# EAGLE schematic Arduino_fuer_LEDs_DCC_Old_1.7 (EAGLE 9.5.2)

## Sheet 1 of 2
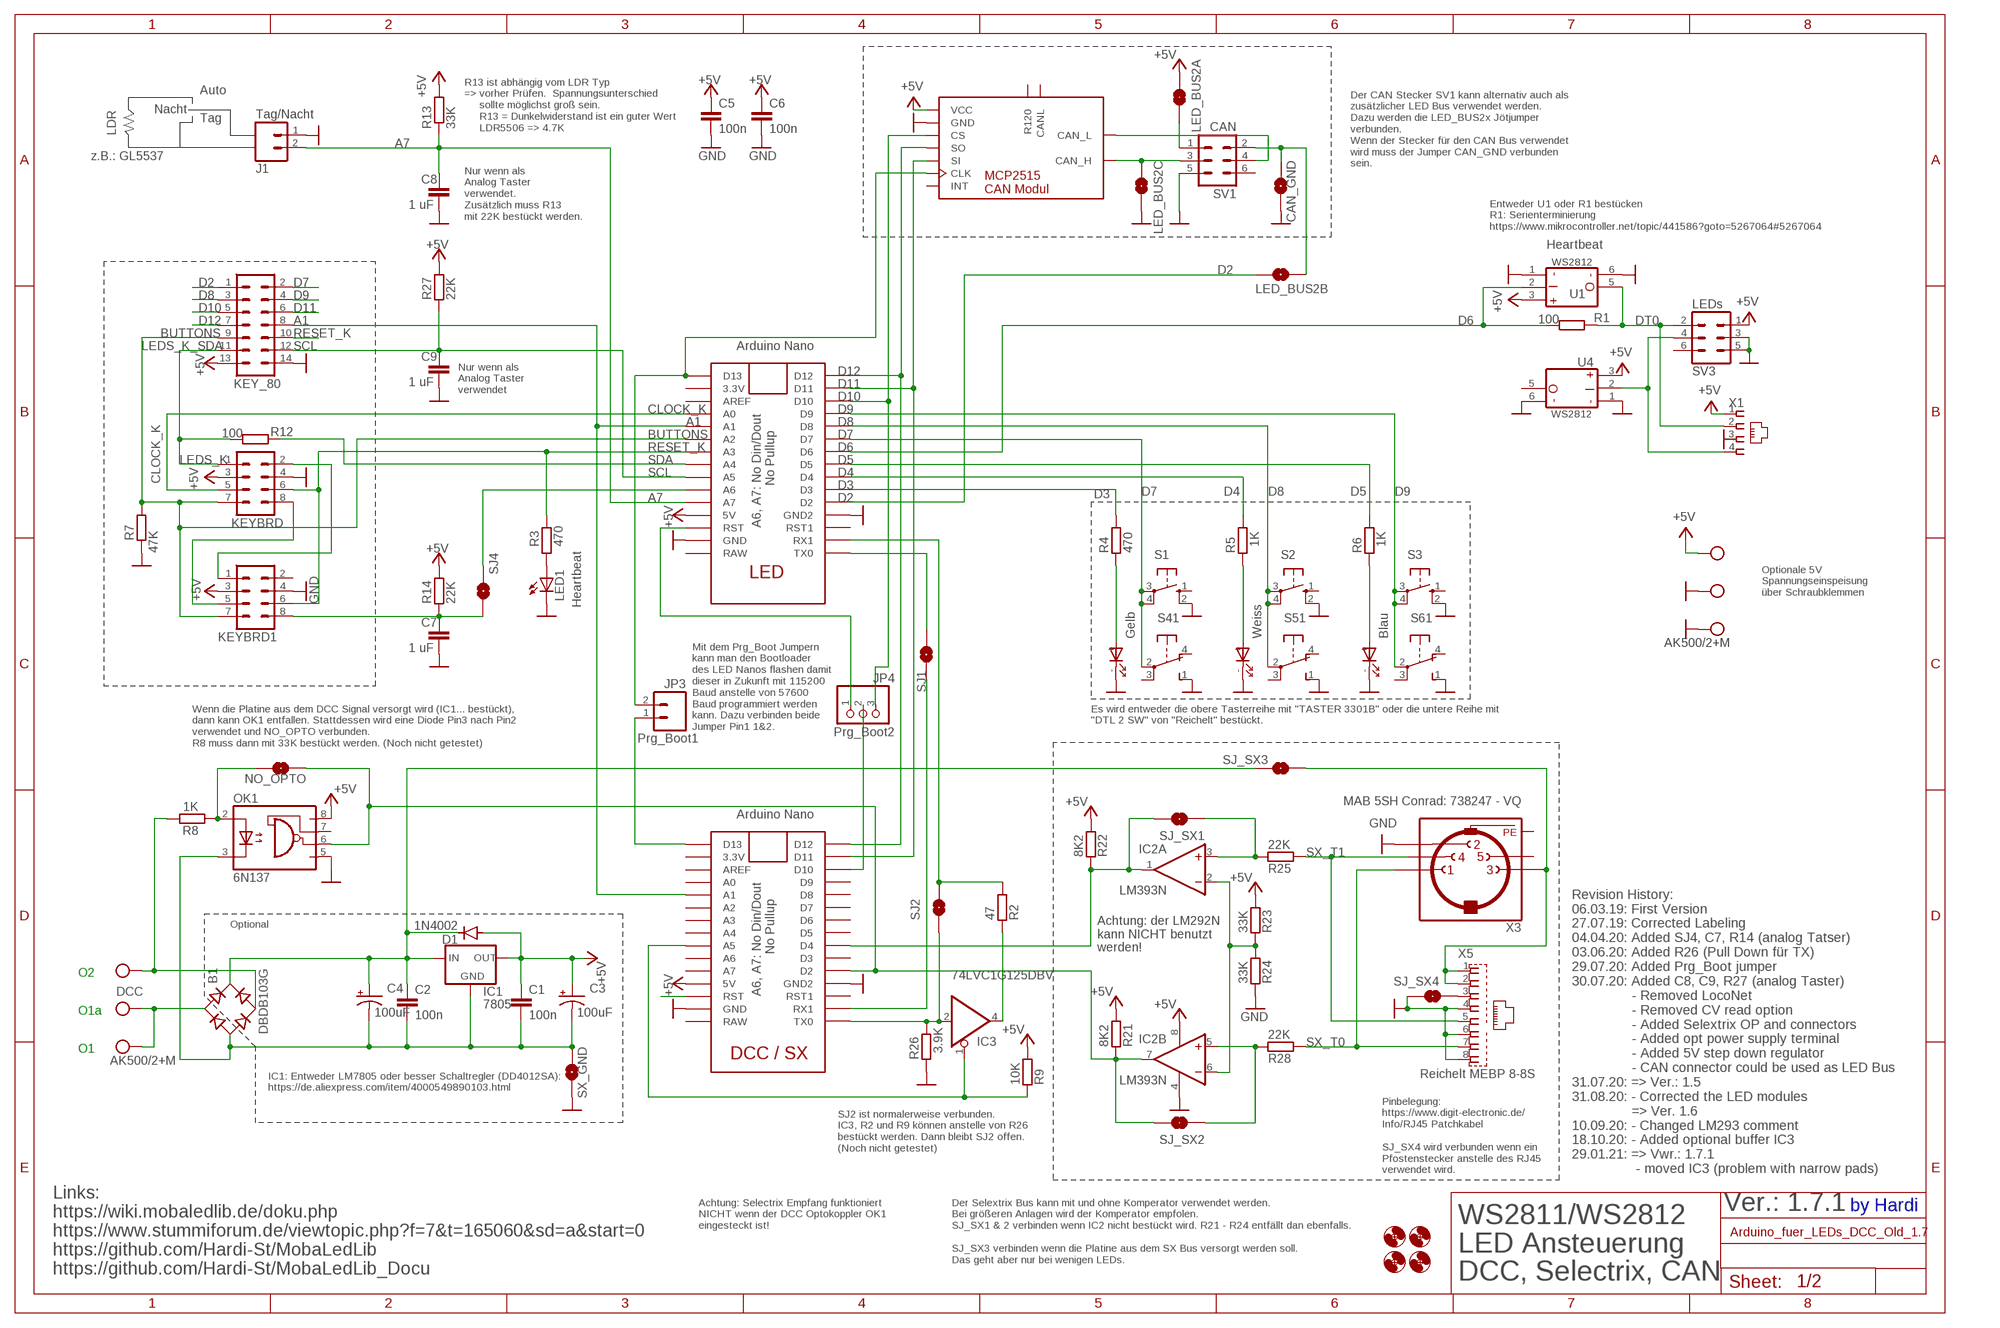
[diagram p0: schematic, sheet 1]

### Parts
B1  DBDB103G  DBDB10G  [DB]
C1  100n  C-EU025-025X050  [C025-025X050]
C2  100n  C-EU025-025X050  [C025-025X050]
C3  100uF  SPARKFUN-CAPACITORS_100UF-25V-20%(PTH)  [SPARKFUN-CAPACITORS_CPOL-RADIAL-100UF-25V]
C4  100uF  SPARKFUN-CAPACITORS_100UF-25V-20%(PTH)  [SPARKFUN-CAPACITORS_CPOL-RADIAL-100UF-25V]
C5  100n  C-EU025-025X050  [C025-025X050]
C6  100n  C-EU025-025X050  [C025-025X050]
C7  1 uF  C-EU025-025X050  [C025-025X050]
C8  1 uF  C-EU025-025X050  [C025-025X050]
C9  1 uF  C-EU025-025X050  [C025-025X050]
CAN2  MCP2515_CAN_MODUL  [MCP2515_CAN_MODUL]
CAN_GND  SOLDERJUMPERNO  [SJ_2S-NO]
D1  1N4002  1N4004  [DO41-10]
H1  MOUNT-HOLE3.0  [3,0]
H2  MOUNT-HOLE3.0  [3,0]
H3  MOUNT-HOLE3.0  [3,0]
H4  MOUNT-HOLE3.0  [3,0]
IC1  7805  78XXS  [78XXS]
IC2  LM393N  [DIL08]
IC3  74LVC1G125DBV  [SOT23-5]
J1  Tag/Nacht  M02PTH  [1X02]
JP3  Prg_Boot1  M02PTH  [1X02]
JP4  Prg_Boot2  PINHD-1X3CB  [1X03-CLEANBIG]
KEY_80  ML14  [ML14]
KEYBRD  CON-HARTING-ML_ML08  [CON-HARTING-ML_ML08]
KEYBRD1  CON-HARTING-ML_ML08  [CON-HARTING-ML_ML08]
LED1  Heartbeat  LED3MM  [LED3MM]
LED_BUS2A  SOLDERJUMPERNO  [SJ_2S-NO]
LED_BUS2B  SOLDERJUMPERNO  [SJ_2S-NO]
LED_BUS2C  SOLDERJUMPERNO  [SJ_2S-NO]
NO_OPTO  SOLDERJUMPERNO  [SJ_2S-NO]
OK1  6N137  [DIL08]
R1  100  R0204/7  [0204/7]
R2  47  R-EU_0204/7  [0204/7]
R3  470  R0204/7  [0204/7]
R4  470  R0204/7  [0204/7]
R5  1K  R0204/7  [0204/7]
R6  1K  R0204/7  [0204/7]
R7  47K  R0204/7  [0204/7]
R8  1K  R0204/7  [0204/7]
R9  10K  R-EU_0204/5  [0204/5]
R12  100  R0204/7  [0204/7]
R13  33K  R0204/7  [0204/7]
R14  22K  R0204/7  [0204/7]
R21  8K2  R-EU_0207/2V  [0207/2V]
R22  8K2  R-EU_0207/2V  [0207/2V]
R23  33K  R-EU_0207/2V  [0207/2V]
R24  33K  R-EU_0207/2V  [0207/2V]
R25  22K  R-EU_0207/2V  [0207/2V]
R26  3.9K  R0204/7  [0204/7]
R27  22K  R0204/7  [0204/7]
R28  22K  R-EU_0207/2V  [0207/2V]
S1  10-XX  [B3F-10XX]
S2  10-XX  [B3F-10XX]
S3  10-XX  [B3F-10XX]
S4  Gelb  SRKL  [SRKL]
S5  Weiss  SRKL  [SRKL]
S6  Blau  SRKL  [SRKL]
SJ1  SOLDERJUMPERNO  [SJ_2S-NO]
SJ2  SOLDERJUMPERNO  [SJ_2S-NO]
SJ4  SOLDERJUMPERNO  [SJ_2S-NO]
SJ_SX1  SOLDERJUMPERNO  [SJ_2S-NO]
SJ_SX2  SOLDERJUMPERNO  [SJ_2S-NO]
SJ_SX3  SOLDERJUMPERNO  [SJ_2S-NO]
SJ_SX4  SOLDERJUMPERNO  [SJ_2S-NO]
SV1  CAN  ML6  [ML6]
SV3  LEDs  ML6  [ML6]
SX_GND  SOLDERJUMPERNO  [SJ_2S-NO]
U1  WS2812_MODUL  [WS2812_LED_MODUL]
U2  LED NANO  NANO  [NANO]
U3  DCC NANO  NANO  [NANO]
U4  WS2812_MODUL  [WS2812_LED_MODUL]
X1  RJ10  [RJ10]
X2  AK500/2+M  [AK500/2+M]
X3  MAB 5SH Conrad: 738247 - VQ  MAB5SH  [MAB5SH]
X4  AK500/2+M  [AK500/2+M]
X5  Reichelt MEBP 8-8S  RJ45_MEBP8-8S  [RJ45_MEBP8-8S]

### Nets
+5V: C1.1 C3.1(+) C5.1 C6.1 CAN2.1(VCC) D1.A IC1.OUT IC2.8(P:V+) KEY_80.13 KEYBRD1.3 KEYBRD.3 LED_BUS2A.1 OK1.8(VCC) R9.2 R13.2 R14.2 R21.2 R22.2 R23.2 R27.2 SV3.1 U1.3(VDD) U2.5V U3.5V U4.3(VDD) X1.1 X4.2 ; also sheet 2
A1: KEY_80.8 U2.A1 U3.A1
A7: C8.1 J1.2 R13.1 U2.A7
BUTTONS: KEY_80.9 KEYBRD1.7 KEYBRD.7 R7.2 U2.A2
CAN_H: CAN2.9(CAN_H) LED_BUS2C.1 SV1.3
CAN_L: CAN2.8(CAN_L) SV1.4
CLOCK_K: KEYBRD.5 U2.A0
D2: KEY_80.1 LED_BUS2B.1 U2.D2
D3: R4.2 U2.D3
D4: R5.2 U2.D4
D5: R6.2 U2.D5
D6: R1.2 U1.2(DIN) U2.D6
D7: KEY_80.2 S1.3(P) S1.4(P1) S4.2(1:P) U2.D7
D8: KEY_80.3 S2.3(P) S2.4(P1) S5.2(1:P) U2.D8
D9: KEY_80.4 S3.3(P) S3.4(P1) S6.2(1:P) U2.D9
D10: CAN2.3(CS) JP4.3 KEY_80.5 U2.D10
D11: CAN2.5(SI) KEY_80.6 U2.D11 U3.D11
D12: CAN2.4(SO) KEY_80.7 U2.D12 U3.D12
DT0: R1.1 SV3.2 U1.5(DO) X1.2 ; also sheet 2
GND: C5.2 C6.2 C7.2 C8.2 C9.2 CAN2.2(GND) CAN_GND.2 IC2.4(P:V-) J1.1 KEY_80.14 KEYBRD1.4 KEYBRD.4 LED1.K(C) LED_BUS2C.2 OK1.5(GND) R7.1 R24.1 R26.1 S1.2(S1) S2.2(S1) S3.2(S1) S4.1(1:S) S4.-(D1:C) S5.1(1:S) S5.-(D1:C) S6.1(1:S) S6.-(D1:C) SJ_SX4.2 SV1.5 SV3.3 SV3.5 SX_GND.2 U1.1(GND) U1.6(GND1) U2.GND U2.GND1(GND2) U3.GND U3.GND1(GND2) U4.1(GND) U4.6(GND1) X1.3 X3.2 X4.1 X4.M X5.4 X5.6 X5.8 ; also sheet 2
LEDS_K_SDA: KEY_80.11 KEYBRD.1 R12.2
N$1: SJ1.2 U2.TX0
N$2: SJ_SX4.1 X5.3
N$3: IC3.1(OE) R9.1 U3.A5
N$4: R4.1 S4.+(D1:A)
N$5: CAN2.6(CLK) JP3.2 U2.D13
N$6: R5.1 S5.+(D1:A)
N$7: R6.1 S6.+(D1:A)
N$8: IC2.7(B:OUT) NO_OPTO.1 OK1.6(VO) R21.1 SJ_SX2.2 U3.D2
N$9: U3.RST
N$10: LED_BUS2A.2 SV1.1
N$11: SV3.4 U4.2(DIN) X1.4
N$12: B1.AC2 R8.2 X2.2
N$13: B1.AC1 X2.1 X2.M
N$14: B1.+ C2.1 C4.1(+) D1.C IC1.IN SJ_SX3.2
N$15: JP4.1 U2.RST
N$16: IC2.1(A:OUT) R22.1 SJ_SX1.2 U3.D4
N$17: B1.- C1.2 C2.2 C3.2(-) C4.2(-) IC1.GND OK1.3(C) SX_GND.1
N$18: SJ1.1 U3.RX1
N$19: LED1.A R3.1
N$20: JP3.1 U3.D13
N$21: NO_OPTO.2 OK1.2(A) R8.1
N$23: C7.1 KEYBRD1.8 R14.1 SJ4.2
N$24: KEYBRD1.1 KEYBRD.2
N$25: KEYBRD1.5 KEYBRD.8
N$26: SJ_SX3.1 X3.3 X5.1 X5.2
N$27: SJ4.1 U2.A6
N$28: JP4.2 U3.D10
N$29: CAN_GND.1 LED_BUS2B.2 SV1.2
N$31: IC3.2(I) R26.2 SJ2.1 U3.TX0
N$33: IC3.4(O) R2.1
N$34: R2.2 SJ2.2 U2.RX1
N$38: IC2.2(A:-IN) IC2.6(B:-IN) R23.1 R24.2
N$39: IC2.3(A:+IN) R25.1 SJ_SX1.1
N$42: IC2.5(B:+IN) R28.1 SJ_SX2.1
RESET_K: KEY_80.10 KEYBRD1.6 KEYBRD.6 R3.2 U2.A3
SCL: C9.1 KEY_80.12 R27.1 U2.A5
SDA: R12.1 U2.A4
SX_T0: R28.2 X3.1 X5.7
SX_T1: R25.2 X3.4 X5.5
Unconnected: CAN2.7(INT) CAN2.10(R120) CAN2.11(CANL) KEYBRD1.2 OK1.7(VE) S1.1(S) S2.1(S) S3.1(S) S4.3(1:P) S4.4(1:O) S5.3(1:P) S5.4(1:O) S6.3(1:P) S6.4(1:O) SV1.6 SV3.6 U2.3.3V U2.AREF U2.RAW U2.RST1 U3.3.3V U3.A0 U3.A2 U3.A3 U3.A4 U3.A6 U3.A7 U3.AREF U3.D3 U3.D5 U3.D6 U3.D7 U3.D8 U3.D9 U3.RAW U3.RST1 U4.5(DO) X3.5

### Notes on the sheet
- R13 ist abhängig vom LDR Typ
  => vorher Prüfen.  Spannungsunterschied
       sollte möglichst groß sein.
       R13 = Dunkelwiderstand ist ein guter Wert
       LDR5506 => 4.7K
- Der CAN Stecker SV1 kann alternativ auch als
  zusätzlicher LED Bus verwendet werden.
  Dazu werden die LED_BUS2x Jötjumper
  verbunden.
  Wenn der Stecker für den CAN Bus verwendet
  wird muss der Jumper CAN_GND verbunden
  sein.
- Auto
- Nacht
- Tag
- LDR
- z.B.: GL5537
- Nur wenn als
  Analog Taster
  verwendet.
  Zusätzlich muss R13 
  mit 22K bestückt werden.
- Entweder U1 oder R1 bestücken 
  R1: Serienterminierung
  https://www.mikrocontroller.net/topic/441586?goto=5267064#5267064
- Heartbeat
- Nur wenn als
  Analog Taster
  verwendet
- LEDS_K
- A6, A7: No Din/Dout 
              No Pullup
- LED
- Optionale 5V
  Spannungseinspeisung
  über Schraubklemmen
- Wenn die Platine aus dem DCC Signal versorgt wird (IC1... bestückt), 
  dann kann OK1 entfallen. Stattdessen wird eine Diode Pin3 nach Pin2
  verwendet und NO_OPTO verbunden.
  R8 muss dann mit 33K bestückt werden. (Noch nicht getestet)
- Es wird entweder die obere Tasterreihe mit "TASTER 3301B" oder die untere Reihe mit 
  "DTL 2 SW" von "Reichelt" bestückt.
- Mit dem Prg_Boot Jumpern
  kann man den Bootloader
  des LED Nanos flashen damit
  dieser in Zukunft mit 115200
  Baud anstelle von 57600
  Baud programmiert werden 
  kann. Dazu verbinden beide
  Jumper Pin1 1&2.
- Optional
- Achtung: der LM292N
  kann NICHT benutzt
  werden!
- O2
- DCC
- A6, A7: No Din/Dout 
              No Pullup
- O1a
- DCC / SX
- O1
- IC1: Entweder LM7805 oder besser Schaltregler (DD4012SA):
  https://de.aliexpress.com/item/4000549890103.html
- Pinbelegung:
  https://www.digit-electronic.de/
  Info/RJ45 Patchkabel
  
  SJ_SX4 wird verbunden wenn ein 
  Pfostenstecker anstelle des RJ45 
  verwendet wird.
- SJ2 ist normalerweise verbunden.
  IC3, R2 und R9 können anstelle von R26
  bestückt werden. Dann bleibt SJ2 offen.
  (Noch nicht getestet)
- Revision History:
  06.03.19: First Version
  27.07.19: Corrected Labeling
  04.04.20: Added SJ4, C7, R14 (analog Tatser)
  03.06.20: Added R26 (Pull Down für TX)
  29.07.20: Added Prg_Boot jumper
  30.07.20: Added C8, C9, R27 (analog Taster)
                 - Removed LocoNet
                 - Removed CV read option
                 - Added Selextrix OP and connectors
                 - Added opt power supply terminal 
                 - Added 5V step down regulator
                 - CAN connector could be used as LED Bus
  31.07.20: => Ver.: 1.5
  31.08.20: - Corrected the LED modules
                 => Ver. 1.6
  10.09.20: - Changed LM293 comment
  18.10.20: - Added optional buffer IC3
  29.01.21: => Vwr.: 1.7.1
                  - moved IC3 (problem with narrow pads)
- Achtung: Selectrix Empfang funktioniert
  NICHT wenn der DCC Optokoppler OK1
  eingesteckt ist!
- Der Selextrix Bus kann mit und ohne Komperator verwendet werden.
  Bei größeren Anlagen wird der Komperator empfolen. 
  SJ_SX1 & 2 verbinden wenn IC2 nicht bestückt wird. R21 - R24 entfällt dan ebenfalls.
  
  SJ_SX3 verbinden wenn die Platine aus dem SX Bus versorgt werden soll.
  Das geht aber nur bei wenigen LEDs.
- Ver.: 1.7.1 | by Hardi
- Links:
  https://wiki.mobaledlib.de/doku.php
  https://www.stummiforum.de/viewtopic.php?f=7&t=165060&sd=a&start=0
  https://github.com/Hardi-St/MobaLedLib
  https://github.com/Hardi-St/MobaLedLib_Docu
- WS2811/WS2812
  LED Ansteuerung
  DCC, Selectrix, CAN

## Sheet 2 of 2
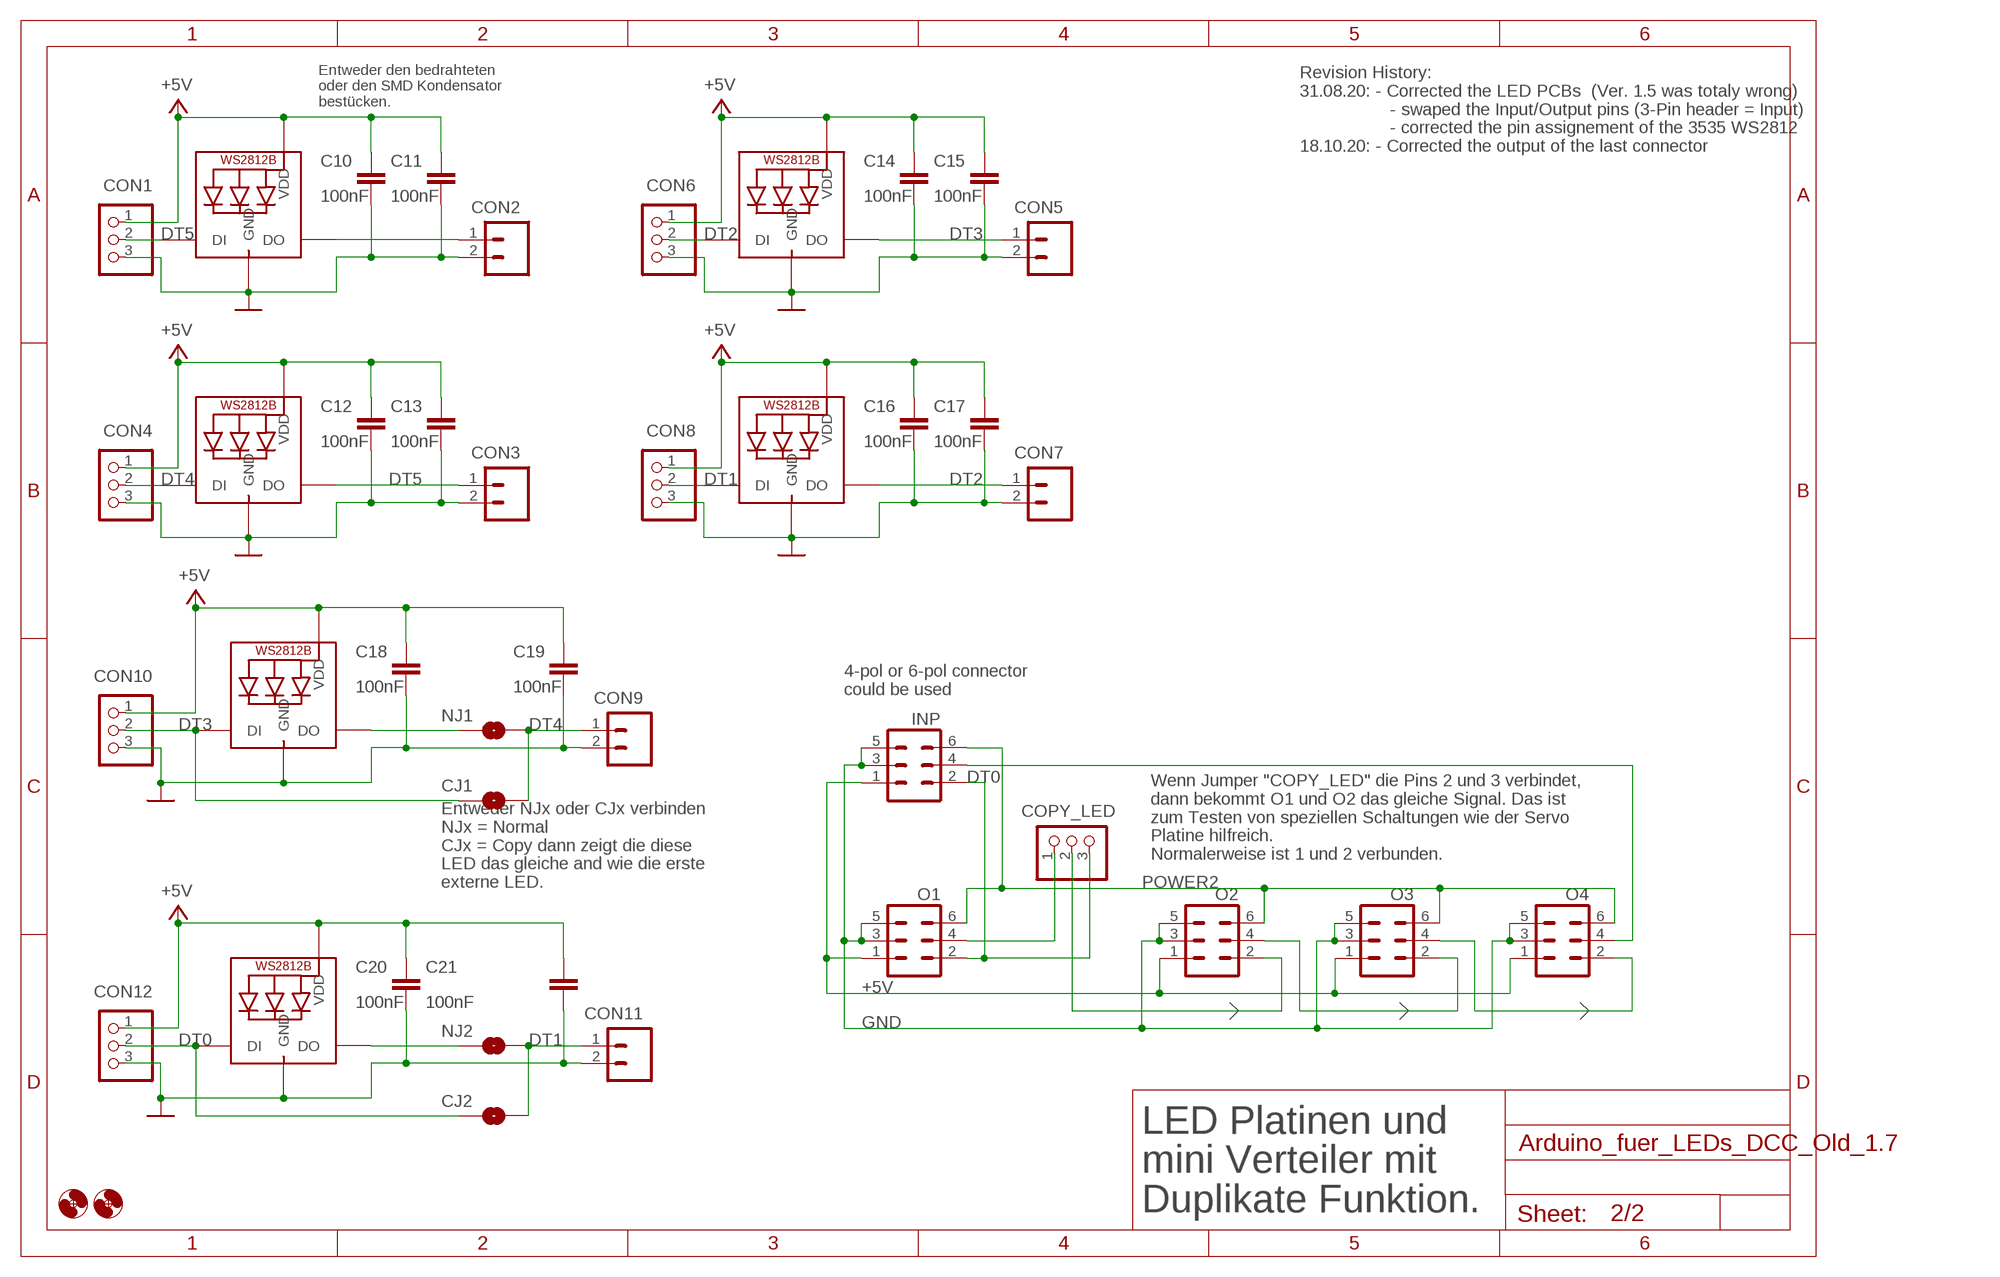
[diagram p1: schematic, sheet 2]

### Parts
C10  100nF  C-EU025-025X050  [C025-025X050]
C11  100nF  C-EUC1206  [C1206]
C12  100nF  C-EU025-025X050  [C025-025X050]
C13  100nF  C-EUC1206  [C1206]
C14  100nF  C-EU025-025X050  [C025-025X050]
C15  100nF  C-EUC1206  [C1206]
C16  100nF  C-EU025-025X050  [C025-025X050]
C17  100nF  C-EUC1206  [C1206]
C18  100nF  C-EU025-025X050  [C025-025X050]
C19  100nF  C-EUC1206  [C1206]
C20  100nF  C-EU025-025X050  [C025-025X050]
C21  100nF  C-EUC1206  [C1206]
CJ1  SOLDERJUMPERNO  [SJ_2S-NO]
CJ2  SOLDERJUMPERNO  [SJ_2S-NO]
CON1  PINHD-1X3CB  [1X03-CLEANBIG]
CON2  M02PTH  [1X02]
CON3  M02PTH  [1X02]
CON4  PINHD-1X3CB  [1X03-CLEANBIG]
CON5  M02PTH  [1X02]
CON6  PINHD-1X3CB  [1X03-CLEANBIG]
CON7  M02PTH  [1X02]
CON8  PINHD-1X3CB  [1X03-CLEANBIG]
CON9  M02PTH  [1X02]
CON10  PINHD-1X3CB  [1X03-CLEANBIG]
CON11  M02PTH  [1X02]
CON12  PINHD-1X3CB  [1X03-CLEANBIG]
COPY_LED  PINHD-1X3CB  [1X03-CLEANBIG]
H5  MOUNT-HOLE3.0  [3,0]
H6  MOUNT-HOLE3.0  [3,0]
INP  ML6  [ML6]
LED2  WS2812B5050  [WS2812B]
LED3  WS2812B5050  [WS2812B]
LED4  WS2812B3535  [LED3535]
LED5  WS2812B3535  [LED3535]
LED6  WS2812B5050  [WS2812B]
LED7  WS2812B3535  [LED3535]
NJ1  SOLDERJUMPERNO  [SJ_2S-NO]
NJ2  SOLDERJUMPERNO  [SJ_2S-NO]
O1  ML6  [ML6]
O2  ML6  [ML6]
O3  ML6  [ML6]
O4  ML6  [ML6]

### Nets
+5V: C10.1 C11.1 C12.1 C13.1 C14.1 C15.1 C16.1 C17.1 C18.1 C19.1 C20.1 C21.1 CON1.1 CON4.1 CON6.1 CON8.1 CON10.1 CON12.1 INP.1 LED2.1-5V(VDD) LED3.1-5V(VDD) LED4.1_5V(VDD) LED5.1_5V(VDD) LED6.1-5V(VDD) LED7.1_5V(VDD) O1.1 O2.1 O3.1 O4.1 ; also sheet 1
DT0: CJ2.1 CON12.2 COPY_LED.3 INP.2 LED7.4_DIN(DI) O1.2 ; also sheet 1
DT1: CJ2.2 CON8.2 CON11.1 LED5.4_DIN(DI) NJ2.2
DT2: CON6.2 CON7.1 LED4.4_DIN(DI) LED5.2_DOUT(DO)
DT3: CJ1.1 CON5.1 CON10.2 LED4.2_DOUT(DO) LED6.4-DIN(DI)
DT4: CJ1.2 CON4.2 CON9.1 LED3.4-DIN(DI) NJ1.2
DT5: CON1.2 CON3.1 LED2.4-DIN(DI) LED3.2-DOUT(DO)
GND: C10.2 C11.2 C12.2 C13.2 C14.2 C15.2 C16.2 C17.2 C18.2 C19.2 C20.2 C21.2 CON1.3 CON2.2 CON3.2 CON4.3 CON5.2 CON6.3 CON7.2 CON8.3 CON9.2 CON10.3 CON11.2 CON12.3 INP.3 INP.5 LED2.3-GND(GND) LED3.3-GND(GND) LED4.3_GND(GND) LED5.3_GND(GND) LED6.3-GND(GND) LED7.3_GND(GND) O1.3 O1.5 O2.3 O2.5 O3.3 O3.5 O4.3 O4.5 ; also sheet 1
N$22: O3.4 O4.2
N$30: CON2.1 LED2.2-DOUT(DO)
N$49: LED6.2-DOUT(DO) NJ1.1
N$52: INP.4 O4.4
N$55: COPY_LED.2 O2.2
N$56: LED7.2_DOUT(DO) NJ2.1
N$58: O2.4 O3.2
N$60: COPY_LED.1 O1.4
POWER2: INP.6 O1.6 O2.6 O3.6 O4.6

### Notes on the sheet
- Entweder den bedrahteten 
  oder den SMD Kondensator 
  bestücken.
- Revision History:
  31.08.20: - Corrected the LED PCBs  (Ver. 1.5 was totaly wrong)
                    - swaped the Input/Output pins (3-Pin header = Input)
                    - corrected the pin assignement of the 3535 WS2812
  18.10.20: - Corrected the output of the last connector
- 4-pol or 6-pol connector
  could be used
- Wenn Jumper "COPY_LED" die Pins 2 und 3 verbindet,
  dann bekommt O1 und O2 das gleiche Signal. Das ist
  zum Testen von speziellen Schaltungen wie der Servo 
  Platine hilfreich.
  Normalerweise ist 1 und 2 verbunden.
- Entweder NJx oder CJx verbinden
  NJx = Normal
  CJx = Copy dann zeigt die diese
  LED das gleiche and wie die erste
  externe LED.
- LED Platinen und
  mini Verteiler mit 
  Duplikate Funktion.

## Power pins joined to a net without a drawn wire
GND: IC3.3(GND)
PE: X3.PE X3.PE@(PE)
VCC: IC3.5(VCC)

## Library data of the parts
B1 = Arduino_fuer_LEDs_DCC_2:DB?*G: Single Phase 1.0 AMP Glass Passivated Bridge Rectifier Taiwan Semiconductor Co.,Ltd. - TSC Source: http://www.taiwansemi.com/TSCbig5/ezcatfiles/cust/img/img/db101g.pdf http://www.ts.com.tw/db/pictures/modules/PDT/PDT060207001/DBLS201G.pdf
C1 C2 C5-C21 = rcl:C-EU: CAPACITOR, European symbol
C3 C4 = Sound_MP3-TF-16P_and_WS2811:SPARKFUN-CAPACITORS_100UF-25V-20%(PTH): CAP-08439; PROD_ID: CAP-08439
CAN2 = Arduino_fuer_LEDs_DCC_2_All:MCP2515_CAN_MODUL: MCP2515 CAN Modul
CAN_GND CJ1 CJ2 LED_BUS2A LED_BUS2B LED_BUS2C NJ1 NJ2 NO_OPTO SJ1 SJ2 SJ4 SJ_SX1-SJ_SX4 SX_GND = SparkFun-Retired:SOLDERJUMPER: Solder Jumper Standard SMD solder jumper. Used to automate production. Two varients : Normally Open and Normally Closed are the same, but have different paste layers. NC will have a large amount of paste and should jumper during reflow.
CON1 CON4 CON6 CON8 CON10 CON12 COPY_LED JP4 = adafruit:PINHD-1X3: PIN HEADER
CON2 CON3 CON5 CON7 CON9 CON11 J1 JP3 = SparkFun-Connectors:M02: Standard 2-pin 0.1" header. Use with - straight break away headers ( PRT-00116) - right angle break away headers (PRT-00553) - swiss pins (PRT-00743) - machine pins (PRT-00117) - female headers (PRT-00115) Molex polarized connector foot print use with: PRT-08233 with associated crimp pins and housings. 2.54_SCREWTERM for use with PRT-10571. 3.5mm Screw Terminal footprints for PRT-08084 5mm Screw Terminal footprints for use with PRT-08432
D1 = diode:1N4004: DIODE general purpose rectifier, 1 A
H1-H6 = holes:MOUNT-HOLE: MOUNTING HOLE with drill center marker
IC1 = v-reg:78XXS: VOLTAGE REGULATOR
IC2 = linear:LM393: COMPARATOR
IC3 = 74xx-little-de:74*1G125: Single Bus Buffer Gate with 3-State Output
INP O1-O4 = con-harting-ml:ML6: HARTING; OC_FARNELL: unknown; OC_NEWARK: unknown
KEY_80 = Arduino_fuer_LEDs_DCC_2:ML14: HARTING; OC_FARNELL: unknown; OC_NEWARK: unknown
KEYBRD KEYBRD1 = PushButtonAction_4017_2:CON-HARTING-ML_ML08: Modified by Hardi; OC_FARNELL: unknown; OC_NEWARK: unknown
LED1 = Arduino_fuer_LEDs_DCC_2:LED: LED OSRAM: - CHIPLED LG R971, LG N971, LY N971, LG Q971, LY Q971, LO R971, LY R971 LH N974, LH R974 LS Q976, LO Q976, LY Q976 LO Q996 - Hyper CHIPLED LW Q18S LB Q993, LB Q99A, LB R99A - SideLED LS A670, LO A670, LY A670, LG A670, LP A670 LB A673, LV A673, LT A673, LW A673 LH A674 LY A675 LS A676, LA A676, LO A676, LY A676, LW A676 LS A679, LY A679, LG A679 - Hyper Micro SIDELED® LS Y876, LA Y876, LO Y876, LY Y876 LT Y87S - SmartLED LW L88C, LW L88S LB L89C, LB L89S, LG L890 LS L89K, LO L89K, LY L89K LS L896, LA L896, LO L896, LY L896 - TOPLED LS T670, LO T670, LY T670, LG T670, LP T670 LSG T670, LSP T670, LSY T670, LOP T670, LYG T670 LG T671, LOG T671, LSG T671 LB T673, LV T673, LT T673, LW T673 LH T674 LS T676, LA T676, LO T676, LY T676, LB T676, LH T676, LSB T676, LW T676 LB T67C, LV T67C, LT T67C, LS T67K, LO T67K, LY T67K, LW E67C LS E67B, LA E67B, LO E67B, LY E67B, LB E67C, LV E67C, LT E67C LW T67C LS T679, LY T679, LG T679 LS T770, LO T770, LY T770, LG T770, LP T770 LB T773, LV T773, LT T773, LW T773 LH T774 LS E675, LA E675, LY E675, LS T675 LS T776, LA T776, LO T776, LY T776, LB T776 LHGB T686 LT T68C, LB T68C - Hyper Mini TOPLED® LB M676 - Mini TOPLED Santana® LG M470 LS M47K, LO M47K, LY M47K Source: http://www.osram.convergy.de LUXEON: - LUMILED® LXK2-PW12-R00, LXK2-PW12-S00, LXK2-PW14-U00, LXK2-PW14-V00 LXK2-PM12-R00, LXK2-PM12-S00, LXK2-PM14-U00 LXK2-PE12-Q00, LXK2-PE12-R00, LXK2-PE12-S00, LXK2-PE14-T00, LXK2-PE14-U00 LXK2-PB12-K00, LXK2-PB12-L00, LXK2-PB12-M00, LXK2-PB14-N00, LXK2-PB14-P00, LXK2-PB14-Q00 LXK2-PR12-L00, LXK2-PR12-M00, LXK2-PR14-Q00, LXK2-PR14-R00 LXK2-PD12-Q00, LXK2-PD12-R00, LXK2-PD12-S00 LXK2-PH12-R00, LXK2-PH12-S00 LXK2-PL12-P00, LXK2-PL12-Q00, LXK2-PL12-R00 Source: www.luxeon.com KINGBRIGHT: KA-3528ASYC Source: www.kingbright.com
LED2-LED7 = adafruit:WS2812B
OK1 = Arduino_fuer_LEDs_DCC_2:6N137: MOTOROLA OPTO COUPLER; MPN: 6N137; OC_FARNELL: 1328376; OC_NEWARK: 52M1895
R1 R3-R8 R12-R14 R26 R27 = Arduino_fuer_LEDs_DCC_2:R: RESISTOR, European symbol; SPICEMODEL: NONE; SPICEPREFIX: R
R2 R9 R21-R25 R28 = rcl:R-EU_: RESISTOR, European symbol
S1-S3 = switch-omron:10-XX: OMRON SWITCH; MPN: B3F-1000; OC_FARNELL: 176432; OC_NEWARK: 36M3542
S4-S6 = switch-misc:SRKL: SWITCH
SV1 SV3 = Arduino_fuer_LEDs_DCC_2:ML6: HARTING; OC_FARNELL: unknown; OC_NEWARK: unknown
U1 U4 = Arduino_fuer_LEDs_DCC_2_All:WS2812_MODUL: WS2812 Modul mit Winkelsteckern (by Hardi)
U2 U3 = Arduino_fuer_LEDs_DCC_2:NANO: Arduino Nano
X1 = RJ10:RJ10: RJ10 Connector "C:\Dat\Märklin\Schaltpläne\Allgemein\RJ10_Stecker_Layout.docx" https://de.aliexpress.com/item/100-pcs-lot-RJ11-Grau-4P4-Telefon-Buchse-4P4C-Telefon-Halter-RJ10-Telefon-Halter-PCB-Empf/32951511491.html?spm=a2g0x.search0604.3.106.53184c516NAPTE&transAbTest=ae803_4&ws_ab_test=searchweb0_0%2Csearchweb201602_3_10065_10068_10547_319_317_10548_10696_10084_453_10083_454_10618_10304_10307_10820_10821_537_10302_536_10902_10843_10059_10884_10887_321_322_10103%2Csearchweb201603_57%2CppcSwitch_0&algo_pvid=cf281ae9-d22a-4418-b1b2-d9dd3eca3a16&algo_expid=cf281ae9-d22a-4418-b1b2-d9dd3eca3a16-15; OC_FARNELL: unknown; OC_NEWARK: unknown
X2 X4 = Arduino_fuer_LEDs_DCC_2:AK500/2+M
X3 = con-hirschmann:MAB5SH: Female CONNECTOR 5 pins 90 deg. with shield, horizontal (DIN 41524); OC_FARNELL: 809883; OC_NEWARK: unknown
X5 = RJ45_Reichelt:RJ45_MEBP8-8S: AMP connector